# Altium schematic sheet Sch1.SchDoc
size 420 x 297 mm; Address1: Address1; Address2: Address2; Address3: Address3; Address4: Address4; DocumentNumber: ADHF20_AB; SheetNumber: 1; Scale: 1:1; DocumentType: Схема электрическая принципиальная; FirstReferrence: ADHF20_AB
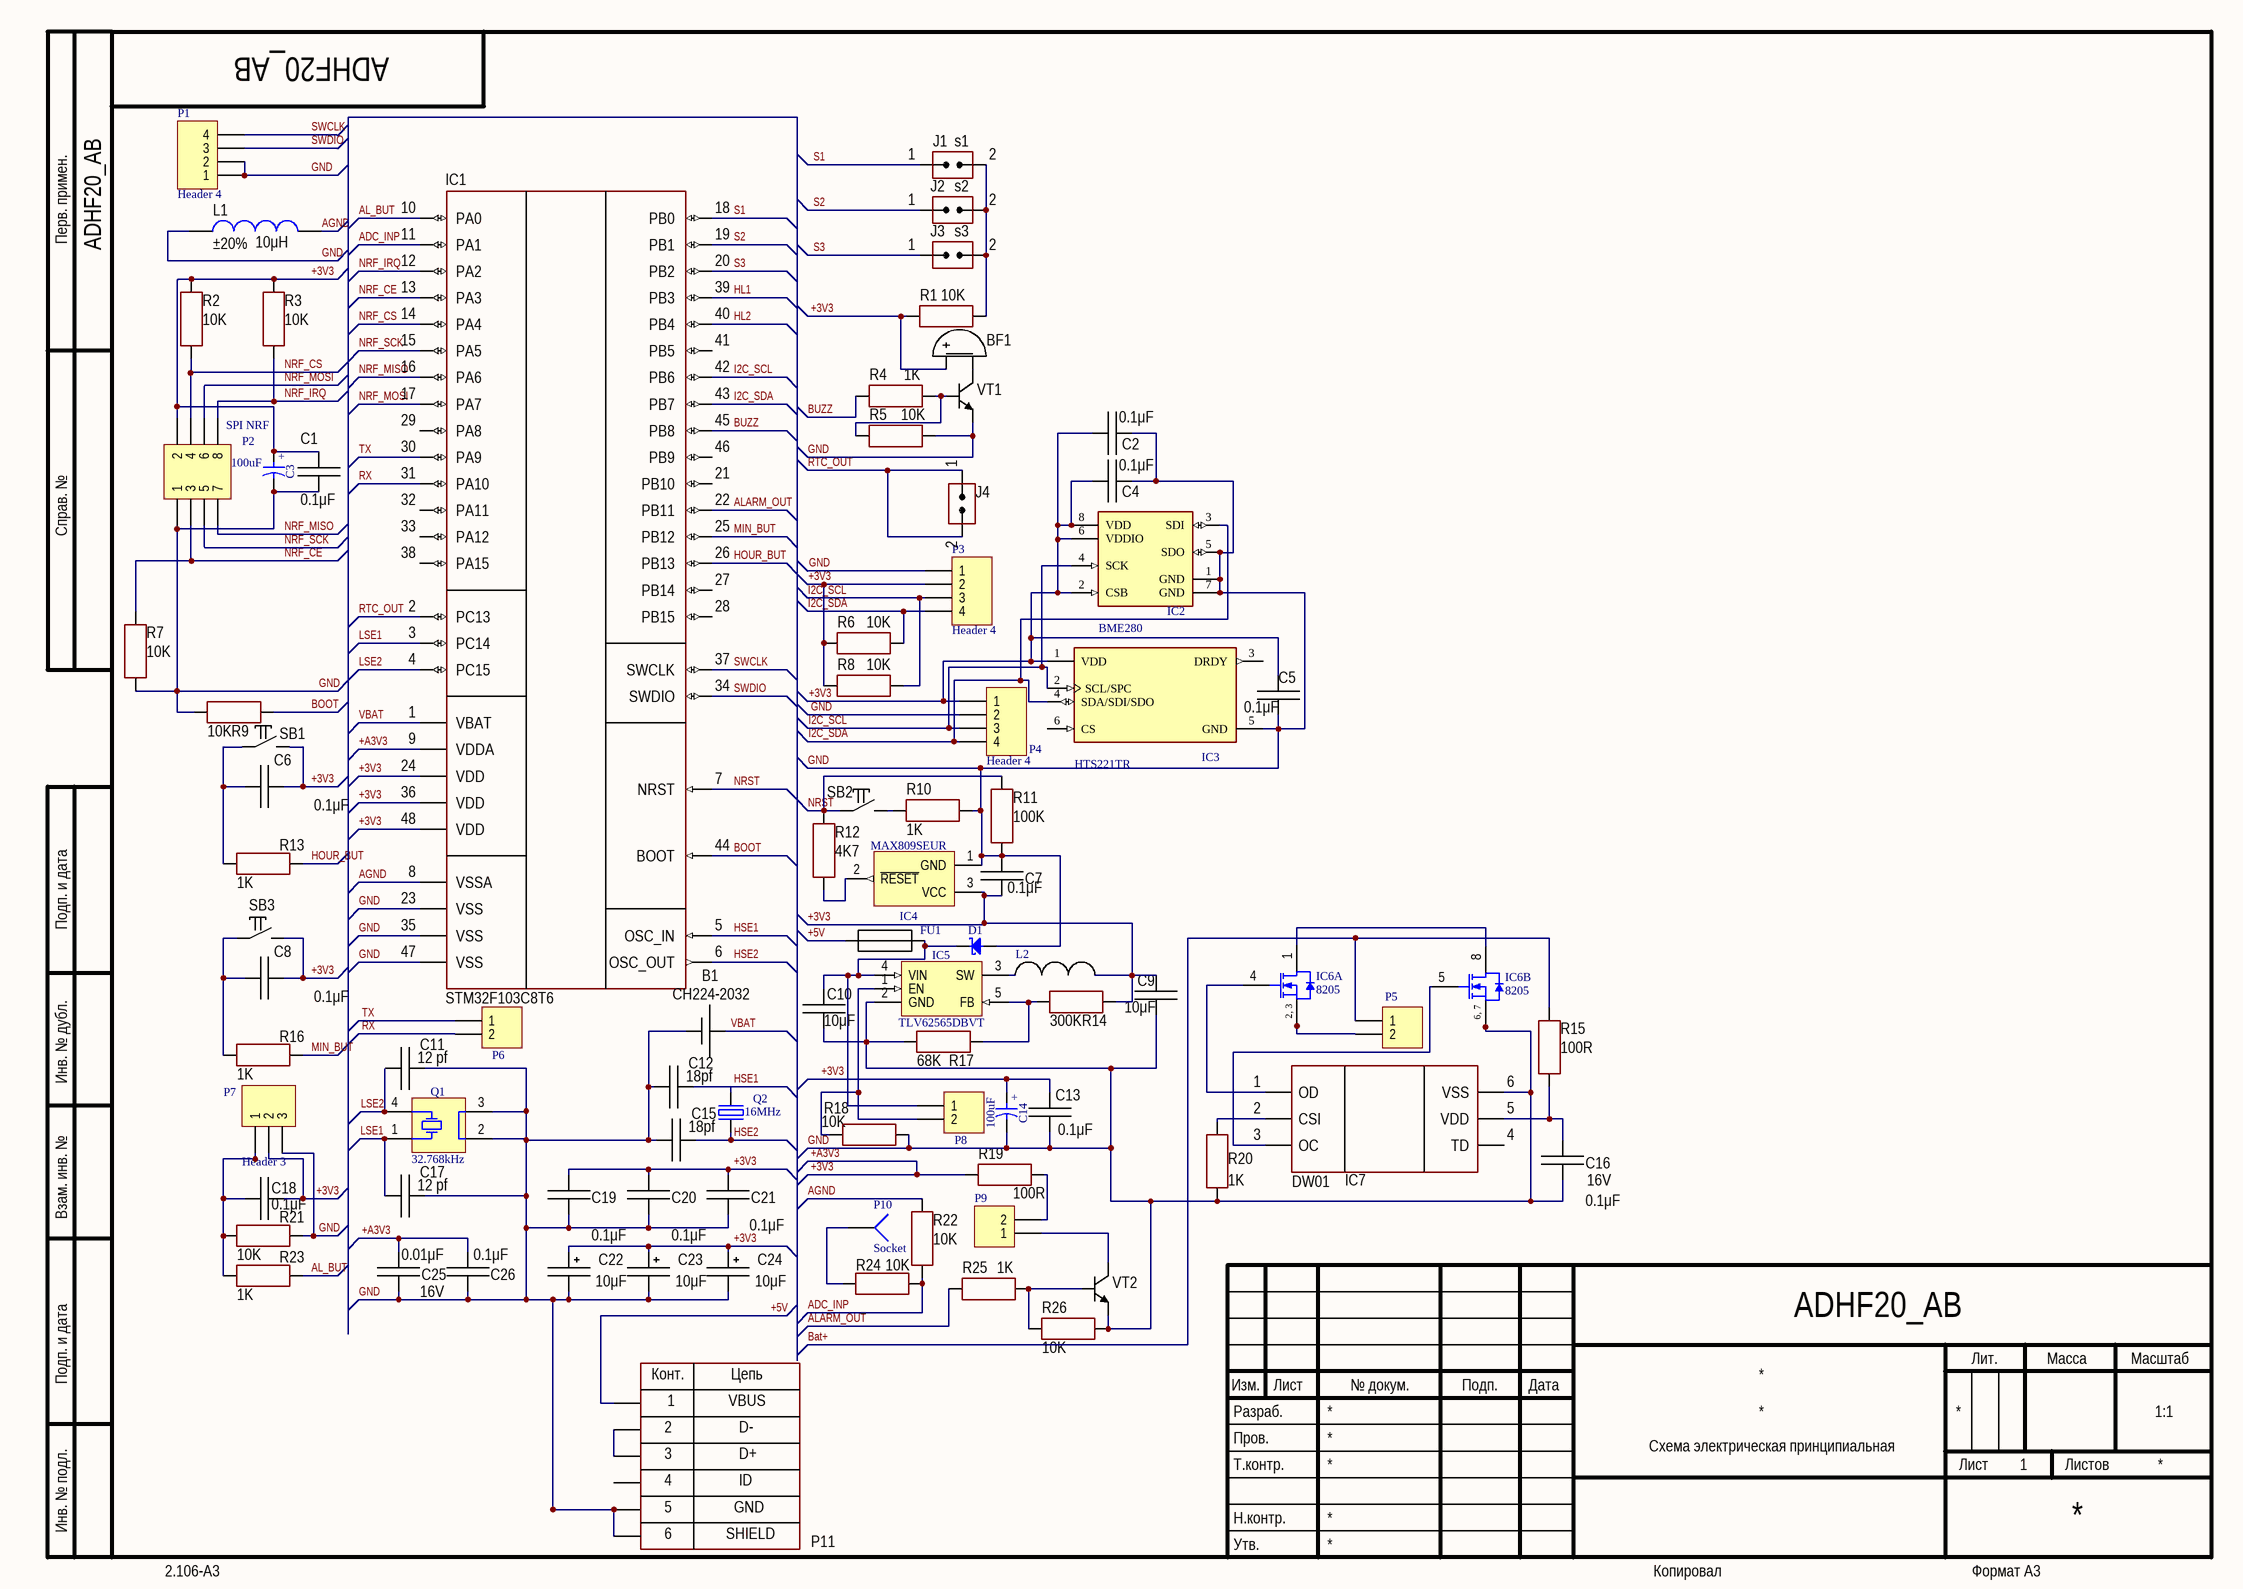
[diagram p0: Sch1.SchDoc]

## Parts
B1  PartNumber: CH224-2032  [BAT: CH224-2032]
BF1  (no value)  [BUZ: AT-0927-TT-6-R]
C1  value 0.1μF  [CAP: 0603]
C2  value 0.1μF  [CAP: 0603]
C3  100uF  [CAPAE660X540N]
C4  value 0.1μF  [CAP: 0603]
C5  value 0.1μF  [CAP: 0603]
C6  value 0.1μF  [CAP: 0603]
C7  value 0.1μF  [CAP: 0603]
C8  value 0.1μF  [CAP: 0603]
C9  value 10μF  [CAP: 0805]
C10  value 10μF  [CAP: 0805]
C11  value 12 pf  [CAP: 0603]
C12  value 18pf  [CAP: 0603]
C13  value 0.1μF  [CAP: 0603]
C14  100uF  [CAPAE660X540N]
C15  value 18pf  [CAP: 0603]
C16  value 0.1μF  Voltage: 16V  [CAP: 0603]
C17  value 12 pf  [CAP: 0603]
C18  value 0.1μF  [CAP: 0603]
C19  value 0.1μF  [CAP: 0603]
C20  value 0.1μF  [CAP: 0603]
C21  value 0.1μF  [CAP: 0603]
C22  value 10μF  [CAP: TANTAL-A]
C23  value 10μF  [CAP: TANTAL-A]
C24  value 10μF  [CAP: TANTAL-A]
C25  value 0.01μF  Voltage: 16V  [CAP: 0603]
C26  value 0.1μF  [CAP: 0603]
D1  Device  [DIOM7659X265N]  (value not drawn)
FU1  1812L010  [C1812Fuse]  (value not drawn)
IC1  (no value)  [48-LQFP]
IC2  BME280  [Bosch_BME280_0]  (value not drawn)
IC3  HTS221TR  [STMicroelectronics_HTS221TR_0]  (value not drawn)
IC4  MAX809SEUR  [SOT95P230X112-3N]
IC5  TLV62565DBVT  [SOT95P280X145-5N]
IC6  8205  [TSSOP-8]  (parts A,B of 2)
IC7  PartNumber: DW01  [SOT23-6]
J1  CommentText: s1  [CON: JUMPER x1]
J2  CommentText: s2  [CON: JUMPER x1]
J3  CommentText: s3  [CON: JUMPER x1]
J4  (no value)  [CON: JUMPER x1]
L1  value 10μH  Tolerance: ±20%  [IND: 0805]
L2  LQH44PN2R2MP0L  [LQH44PP(1515)]  (value not drawn)
P1  Header 4  [HDR1X4]
P2  SPI NRF  [HDR2X4]
P3  Header 4  [HDR1X4]
P4  Header 4  [HDR1X4]
P5  Header 2  [HDR1X2]  (value not drawn)
P6  Header 2  [HDR1X2]  (value not drawn)
P7  Header 3  [HDR1X3]
P8  Header 2  [HDR1X2]  (value not drawn)
P9  Header 2  [HDR1X2]  (value not drawn)
P10  Socket  [PIN1]
P11  (no value)  [CON: USB micro-A (ZX62-B-5PA)]
Q1  32.768kHz  [XTAL_EPSON_MC-406]
Q2  16MHz  [XTAL1160X490X430]
R1  value 10K  [RES: 0603]
R2  value 10K  [RES: 0603]
R3  value 10K  [RES: 0603]
R4  value 1K  [RES: 0603]
R5  value 10K  [RES: 0603]
R6  value 10K  [RES: 0603]
R7  value 10K  [RES: 0603]
R8  value 10K  [RES: 0603]
R9  value 10K  [RES: 0603]
R10  value 1K  [RES: 0603]
R11  value 100K  [RES: 0603]
R12  value 4K7  [RES: 0603]
R13  value 1K  [RES: 0603]
R14  value 300K  [RES: 0603]
R15  value 100R  [RES: 0603]
R16  value 1K  [RES: 0603]
R17  value 68K  [RES: 0603]
R18  value 10K  [RES: 0603]
R19  value 100R  [RES: 1206]
R20  value 1K  [RES: 0603]
R21  value 10K  [RES: 0603]
R22  value 10K  [RES: 0603]
R23  value 1K  [RES: 0603]
R24  value 10K  [RES: 0603]
R25  value 1K  [RES: 0603]
R26  value 10K  [RES: 0603]
SB1  (no value)  [BUT: 6x6]
SB2  (no value)  [BUT: 6x6]
SB3  (no value)  [BUT: 6x6]
VT1  (no value)  [SOT23]
VT2  (no value)  [SOT23]

## Nets
+3V3: BF1.1(+) C1.2 C2.1 C3.1 C4.1 C5.2 C6.2 C7.1 C8.2 C9.2 C13.2 C14.1 C18.2 C19.2 C20.2 C21.2 C22.1 C23.1 C24.1 C25.2 C26.2 IC1.9(VDDA) IC1.24(VDD) IC1.36(VDD) IC1.48(VDD) IC2.2(CSB) IC2.6(VDDIO) IC2.8(VDD) IC3.1(VDD) IC4.3(VCC) L2.2 P2.2 P3.2 P4.1 P7.2 R1.1 R2.2 R3.2 R6.2 R8.2 R14.1 R19.1 SB1.2 SB3.2  [also labelled +A3V3]
+5V: FU1.2 P11.1
ADC_INP: IC1.11(PA1) R22.1 R24.1
AGND: IC1.8(VSSA) L1.1 R22.2
AL_BUT: IC1.10(PA0) R23.2
ALARM_OUT: IC1.22(PB11) R25.1
Bat+: P5.1 R15.1
BOOT: IC1.44(BOOT) R9.1
BUZZ: IC1.45(PB8) R4.1
GND: B1.2(-) C1.1 C2.2 C3.2 C4.2 C5.1 C7.2 C9.1 C10.1 C11.2 C12.1 C13.1 C14.2 C15.1 C16.1 C17.2 C19.1 C20.1 C21.1 C22.2 C23.2 C24.2 C25.1 C26.1 D1.2(A) IC1.23(VSS) IC1.35(VSS) IC1.47(VSS) IC2.1(GND) IC2.5(SDO) IC2.7(GND) IC3.5(GND) IC4.1(GND) IC5.2(GND) IC6.6(S) IC6.7(S) IC7.6(VSS) L1.2 P1.1 P1.2 P2.1 P3.1 P4.2 P7.3 P11.0 P11.5 Q1.2(GND) Q1.3(GND) R5.2 R7.1 R9.2 R10.2 R11.2 R17.1 R18.1 R20.1 R21.2 R26.1 VT1.2(E) VT2.2(E)
HL1: IC1.39(PB3)
HL2: IC1.40(PB4)
HOUR_BUT: IC1.26(PB13) R13.2
HSE1: C12.2 IC1.5(OSC_IN) Q2.2(OSC2)
HSE2: C15.2 IC1.6(OSC_OUT) Q2.1(OSC1)
I2C_SCL: IC1.42(PB6) IC2.4(SCK) IC3.2(SCL/SPC) P3.3 P4.3 R8.1
I2C_SDA: IC1.43(PB7) IC2.3(SDI) IC3.4(SDA/SDI/SDO) P3.4 P4.4 R6.1
LSE1: C17.1 IC1.3(PC14) Q1.1(X)
LSE2: C11.1 IC1.4(PC15) Q1.4(X)
MIN_BUT: IC1.25(PB12) R16.2
NRF_CE: IC1.13(PA3) P2.3 R7.2
NRF_CS: IC1.14(PA4) P2.4 R2.1
NRF_IRQ: IC1.12(PA2) P2.8 R3.1
NRF_MISO: IC1.16(PA6) P2.7
NRF_MOSI: IC1.17(PA7) P2.6
NRF_SCK: IC1.15(PA5) P2.5
NRST: IC1.7(NRST) R11.1 R12.2 SB2.1
RTC_OUT: IC1.2(PC13) J4.1(IN) J4.2(IN)
RX: IC1.31(PA10) P6.2
S1: IC1.18(PB0) J1.1(IN)
S2: IC1.19(PB1) J2.1(IN)
S3: IC1.20(PB2) J3.1(IN)
SWCLK: IC1.37(SWCLK) P1.4
SWDIO: IC1.34(SWDIO) P1.3
TX: IC1.30(PA9) P6.1
VBAT: B1.1(+) IC1.1(VBAT)
NetBF1_2: BF1.2(-) VT1.3(C)
NetC6_1: C6.1 R13.1 SB1.1
NetC8_1: C8.1 R16.1 SB3.1
NetC10_2: C10.2 D1.1(C) FU1.1 IC5.4(VIN) P8.1
NetC16_2: C16.2 IC7.5(VDD) R15.2
NetC18_1: C18.1 P7.1 R21.1 R23.1
NetIC4_2: IC4.2(~{RESET}) R12.1
NetIC5_1: IC5.1(EN) P8.2 R18.2
NetIC5_3: IC5.3(SW) L2.1
NetIC5_5: IC5.5(FB) R14.2 R17.2
NetIC6_1: IC6.1(D) IC6.8(D)
NetIC6_2: IC6.2(S) IC6.3(S) P5.2
NetIC6_4: IC6.4(G) IC7.1(OD)
NetIC6_5: IC6.5(G) IC7.3(OC)
NetIC7_2: IC7.2(CSI) R20.2
NetJ1_2: J1.2(IN) J2.2(IN) J3.2(IN) R1.2
NetP9_1: P9.1 VT2.3(C)
NetP9_2: P9.2 R19.2
NetP10_1: P10.1 R24.2
NetP11_2: P11.2 P11.3
NetR4_2: R4.2 R5.1 VT1.1(B)
NetR10_1: R10.1 SB2.2
NetR25_2: R25.2 R26.2 VT2.1(B)

Not connected (* = marked no-connect by the designer): IC1 21(PB10) 27(PB14) 28(PB15) 29(PA8) 32(PA11) 33(PA12) 38(PA15) 41(PB5) 46(PB9); IC3 3(DRDY) 6(CS); IC7 4(TD); P11 4

## Notes on the sheet
- Перв. примен.
- Справ. №
- Подп. и дата
- Инв. № дубл.
- Взам. инв. №
- Разраб.
- Изм.
- Лист
- № докум.
- Подп.
- Дата
- Лит.
- Масса
- Масштаб
- Пров.
- Т.контр.
- Листов
- Инв. № подл.
- Утв.
- Н.контр.
- 2.106-A3
- Копировал
- Формат А3
- (in symbol CAE660-540_100UF_16V_20%) +
- (in symbol Connector_USB_micro_B) Конт.; Цепь; VBUS; D-; D+; ID; GND; 6; SHIELD
- (in symbol SI6956DQ, part A) 2, 3
- (in symbol SI6956DQ, part B) 6, 7

## Library data of the parts
B1 = Connector_CH224-2032: Manufacturer: KLS; ValueManufacturerPartNumber: Single battery CR2032; CommentText: CR2032; HelpURL: https://www.chipdip.ru/product/bh-642; TypeConnector: Single battery CR2032
BF1 = Buzzer: Manufacturer: PUI Audio; ValueManufacturerPartNumber: DIP switch, 2.73 kHz, 3VDC, 80mA, -20...+70°C; PartNumber: AT-0927-TT-6-R; TypeBuzzer: DIP switch; VoltageMax: 3VDC; Frequency: 2.73 kHz; CurrentMax: 80mA; HelpURL: https://www.digikey.com/products/en?keywords=AT-0927-TT-6-R; Temperature: -20...+70°C
C1 C5 = Ceramic_0603: Manufacturer: Yageo; PartNumber: CC0603KRX7R7BB104; TypeCapacitor: Ceramic capacitor; Tolerance: ±10%; TypeDielectric: X7R; Package: 0603; HelpURL: https://www.digikey.com/product-detail/en/yageo/CC0603KRX7R7BB104/311-1088-1-ND/302998; ValueManufacturerPartNumber: =TypeCapacitor+', '+Value+', '+TypeDielectric+', '+Tolerance+', '+Voltage+', '+Package+', '+Temperature; Temperature: -55...+125°C
C2 C4 C6-C8 C13 C18-C21 C26 = Ceramic_0603: Manufacturer: Yageo; PartNumber: CC0603KRX7R7BB104; ValueManufacturerPartNumber: Ceramic capacitor, 0.1μF, X7R, ±10%, 16V, 0603, -55...+125°C; TypeCapacitor: Ceramic capacitor; Tolerance: ±10%; TypeDielectric: X7R; Voltage: 16V; Package: 0603; HelpURL: https://www.digikey.com/product-detail/en/yageo/CC0603KRX7R7BB104/311-1088-1-ND/302998; Temperature: -55...+125°C
C3 C14 = CAE660-540_100UF_16V_20%: Polarised capacitor; Part Description: Aluminum Electrolytic SMT Capacitor; Manufacturer: PANASONIC; Manufacturer Part Number: EEEFK1C101AP; Voltage: 16V; Tolerance: ±20%; Part Number: CAE660-540_100UF_16V_20%; Component Kind: Standard; Component Type: Standard; Pin Count: 2; Value: 100uF; Status: Not Recommended; Case: D; Mounted: Yes; Socket: No; SMD: Yes; Sense: No; ComponentHeight: 5.8mm; HelpURL: \\cern.ch\dfs\Applications\Altium\Datasheets\CAE_PANASONIC_FK.pdf; Author: CERN DEM JLC; CreateDate: 03.12.2007; LatestRevisionDate: 05.11.2014
C9 C10 = Ceramic_0805: Manufacturer: Murata Electronics; PartNumber: GCD21BR72A104KA01L; ValueManufacturerPartNumber: Ceramic capacitor, 10μF, X7R, ±10%, , 0805, -55...+125°C; TypeCapacitor: Ceramic capacitor; Tolerance: ±10%; TypeDielectric: X7R; Package: 0805; HelpURL: https://www.digikey.com/product-detail/en/murata-electronics/GCD21BR72A104KA01L/490-14407-1-ND/6606868; Temperature: -55...+125°C
C11 C17 = Ceramic_0603: Manufacturer: Yageo; PartNumber: CC0603KRX7R7BB104; ValueManufacturerPartNumber: Ceramic capacitor, 12 pf, X7R, ±10%, 16V, 0603, -55...+125°C; TypeCapacitor: Ceramic capacitor; Tolerance: ±10%; TypeDielectric: X7R; Voltage: 16V; Package: 0603; HelpURL: https://www.digikey.com/product-detail/en/yageo/CC0603KRX7R7BB104/311-1088-1-ND/302998; Temperature: -55...+125°C
C12 C15 = Ceramic_0603: Manufacturer: Yageo; PartNumber: CC0603KRX7R7BB104; ValueManufacturerPartNumber: Ceramic capacitor, 18pf, X7R, ±10%, 16V, 0603, -55...+125°C; TypeCapacitor: Ceramic capacitor; Tolerance: ±10%; TypeDielectric: X7R; Voltage: 16V; Package: 0603; HelpURL: https://www.digikey.com/product-detail/en/yageo/CC0603KRX7R7BB104/311-1088-1-ND/302998; Temperature: -55...+125°C
C16 = Ceramic_0603: Manufacturer: Yageo; PartNumber: CC0603KRX7R7BB104; ValueManufacturerPartNumber: Ceramic capacitor, 0.1μF, X7R, ±10%, 16V, 0603, -55...+125°C; TypeCapacitor: Ceramic capacitor; Tolerance: ±10%; TypeDielectric: X7R; Package: 0603; HelpURL: https://www.digikey.com/product-detail/en/yageo/CC0603KRX7R7BB104/311-1088-1-ND/302998; Temperature: -55...+125°C
C22-C24 = Tantal_A: Manufacturer: Vishay Sprague; PartNumber: 293D106X96R3A2TE3; ValueManufacturerPartNumber: Tantalum capacitor, 10μF, 6.3V, ±10%, 3.4Ohm, case A (3216), -55...+125°C; Impedance: 3.4Ohm; Tolerance: ±10%; TypeDielectric: X7R; TypeCapacitor: Tantalum capacitor; Voltage: 6.3V; Package: case A (3216); HelpURL: https://www.digikey.com/product-detail/en/vishay-sprague/293D106X96R3A2TE3/718-1126-1-ND/1559620; Temperature: -55...+125°C
C25 = Ceramic_0603: Manufacturer: Yageo; PartNumber: CC0603KRX7R7BB104; ValueManufacturerPartNumber: Ceramic capacitor, 0.01μF, X7R, ±10%, 16V, 0603, -55...+125°C; TypeCapacitor: Ceramic capacitor; Tolerance: ±10%; TypeDielectric: X7R; Package: 0603; HelpURL: https://www.digikey.com/product-detail/en/yageo/CC0603KRX7R7BB104/311-1088-1-ND/302998; Temperature: -55...+125°C
D1 = SS34: Schottky Diode; Part Number: SS34; Part Description: Surface Mount Schottky Barrier Rectifier; Manufacturer: FAIRCHILD SEMICONDUCTOR; Voltage: 40V; Power: 3A; PressFit: No; Bonding: No; Component Kind: Standard; Component Type: Standard; Device: SS34; PackageDescription: DO-214-AB/SMC Molded Diode, Body 7.95x5.9mm, IPC Medium Density; Manufacturer Part Number: SS34; Pin Count: 2; Case: DO-214AC; Mounted: Yes; Socket: No; SMD: Yes; Sense: No; ComponentHeight: 2.65mm; HelpURL: \\cern.ch\dfs\Applications\Altium\Datasheets\SS34.pdf; Author: CERN DEM JLC; CreateDate: 23.08.2010; LatestRevisionDate: 23.08.2010
FU1 = 1812L010: SMD 1812 0,3А 30V; Manufacturer: Littelfuse, Inc.; BOM: 1812L010, 1812 0,3A 30V; Current: 0,3A; Part Number: 1812L010; Package: SMD 1812; Footprint Patch: pcb.pcblib; Voltage: 30V; ComponentLink1URL: https://sds.compel.ru/item-pdf/b89835bf867f48e848cf72775db4e3e5/ps/ltl~polyfusev---1812l.pdf; ComponentLink1Description: Datasheet; Category: FUSE
IC1 = STM32F103C8T6: Cortex-M3; Manufacturer: STMicroelectronics; ValueManufacturerPartNumber: IC microcontroller, 32-Bit, Cortex-M3, 72MHz, 64KB, 20KB, 2...3.6V, -40...+85°C, 48-LQFP; Supply: 2...3.6V; Speed: 72MHz; CoreSize: 32-Bit; MemoryROM: 64KB; MemoryRAM: 20KB; HelpURL: https://www.digikey.com/product-detail/en/stmicroelectronics/STM32F103C8T6TR/497-17666-1-ND/7804402; Package: 48-LQFP; ComponentType: IC microcontroller; Temperature: -40...+85°C; CoreProcessor: Cortex-M3; PartNumber: STM32F103C8T6
IC2 = BME280: IC Humidity, Pressure, Temperature Sensor I²C Output; Manufacturer: Bosch; Capacitance: SKIP; Library Path1: parts/IC_Bosch_BME280_eec.SchLib; Value: SKIP; Part Number: BME280; Datasheet Path: datasheets/IC_Bosch_BME280_eec.pdf; ComponentLink1Description: Upverter; ComponentLink1URL: https://upverter.com/upn/revision/d5e36e2395010120/; ComponentLink2Description: Datasheet; ComponentLink2URL: http://datasheet.octopart.com/BME280-Bosch-datasheet-34148998.pdf; Datasheet Path1: datasheets/IC_Bosch_BME280_eec.pdf; Digikey Description: IC Humidity, Pressure, Temperature Sensor I²C Output; Digikey Part Number: 828-1063-1-ND; Inductance: SKIP; Lead Free: yes; Library Ref1: BME280; Mouser Part Number: 262-BME280; Octopart Part Number: a1c26bef29297e05; Package: DFN8; Price: 6.22612925365; Resistance: SKIP; RoHS: TRUE; Supplier 1: Digi-Key; Supplier 2: Mouser; Supplier Part Number 1: 828-1063-1-ND; Supplier Part Number 2: 262-BME280; Temperature: -40°C to +85°C; Temperature Range High: +85°C; Temperature Range Low: -40°C; Voltage: SKIP; helpURL: https://upverter.com/upn/revision/d5e36e2395010120/
IC3 = HTS221TR: IC SENS HUMI/TEMP 2.5V I2C 4.5% SMD; Manufacturer: STMicroelectronics; Capacitance: SKIP; Interface: I2C,SPI,Other; Library Path1: parts/IC_STMicroelectronics_HTS221TR_eec.SchLib; Max Supply Voltage: 3.6V; Min Supply Voltage: 1.7V; Operating Supply Current: 2uA; Resolution: 16b; Standoff Height: 0mm; Value: SKIP; Verification Version: 0.0.0.1; Part Number: HTS221TR; Datasheet Path: datasheets/IC_STMicroelectronics_HTS221TR_eec.pdf; Accuracy: 4.5%; ComponentLink1Description: Upverter; ComponentLink1URL: https://upverter.com/upn/revision/23fd6bd49ff9d81b/; ComponentLink2Description: Datasheet; ComponentLink2URL: http://www.st.com/content/ccc/resource/technical/document/datasheet/4d/9a/9c/ad/25/07/42/34/DM00116291.pdf/files/DM00116291.pdf/jcr:content/translations/en.DM00116291.pdf; Datasheet Path1: datasheets/IC_STMicroelectronics_HTS221TR_eec.pdf; Digikey Description: IC SENS HUMI/TEMP 2.5V I2C 4.5% SMD; Digikey Part Number: 497-15382-1-ND; Footprint Url: http://www.st.com/content/ccc/resource/technical/document/technical_note/3a/39/78/0d/81/40/4c/0d/DM00150328.pdf/files/DM00150328.pdf/jcr:content/translations/en.DM00150328.pdf; Height: 1mm; Inductance: SKIP; Lead Free: yes; Library Ref1: HTS221TR; Mouser Part Number: 511-HTS221TR; Package: HTS221TR; Price: 2.44531532234; Resistance: SKIP; RoHS: TRUE; Sensor Output: I2C,SPI,Other; Supplier 1: Digi-Key; Supplier 2: Mouser; Supplier Part Number 1: 497-15382-1-ND; Supplier Part Number 2: 511-HTS221TR; Temperature: -40°C to +120°C; Temperature Range High: +120°C; Temperature Range Low: -40°C; Voltage: SKIP; helpURL: https://upverter.com/upn/revision/23fd6bd49ff9d81b/
IC4 = MAX809MEUR: 3-Pin Microprocessor Reset Circuit; Part Description: 3-Pin Microprocessor Reset Circuit (Reset Threshold 4.38V); Manufacturer: MAXIM; PressFit: No; Bonding: No; Part Number: MAX809SEUR; Component Kind: Standard; Component Type: Standard; Device: MAX809SEUR; PackageDescription: SOT23 3-Leads, Pitch 0.95mm - Body 1.3x2.86mm, IPC Medium Density; Manufacturer Part Number: MAX809SEUR; Pin Count: 3; Case: SOT23; Mounted: Yes; Socket: No; SMD: Yes; Sense: No; ComponentHeight: 1.12mm; HelpURL: \\cern.ch\dfs\Applications\Altium\Datasheets\MAX809MEUR.pdf; Author: CERN DEM JLC; CreateDate: 23.08.2012; LatestRevisionDate: 23.08.2012
IC5 = TLV62565DBVT: 1.5A High Efficiency Step-Down Converter, Adjustable Output Voltage; Manufacturer: TEXAS INSTRUMENTS; PressFit: No; Bonding: No; Part Number: TLV62565DBVT; Component Kind: Standard; Component Type: Standard; Device: TLV62565DBVT; PackageDescription: SOT, 0.95mm Pitch; 5 Pin, 1.60mm W X 2.90mm L X 1.45mm H Body, IPC Medium Density; Part Description: 1.5A High Efficiency Step-Down Converter, Adjustable Output Voltage; Manufacturer Part Number: TLV62565DBVT; Pin Count: 5; Case: SOT23-5; Mounted: Yes; Socket: No; SMD: Yes; Sense: No; ComponentHeight: 1.45mm; HelpURL: \\cern.ch\dfs\Applications\Altium\Datasheets\TLV62565DBVT.pdf; Author: CERN DEM JMW; CreateDate: 29.08.2016; LatestRevisionDate: 29.08.2016
IC6 = SI6956DQ: Dual N-Channel Enhancement-Mode  MOSFET; Published: 8-Jun-2000; LatestRevisionDate: 04-Mar-2005; LatestRevisionNote: Stylized 3D Model Added.; DatasheetVersion: 15-Apr-1996; PackageVersion: Aug-1998; PackageReference: TSSOP-8; Publisher: Altium Limited; PackageDescription: Shrink Small Outline; 8 Leads; Body Width 4.4 mm; Pitch 0.65 mm; ComponentLink1Description: Manufacturer Link; ComponentLink1URL: http://www.vishay.com/; ComponentLink2Description: Datasheet; ComponentLink2URL: http://www.vishay.com/docs/70173/70173.pdf
IC7 = SN6505ADBVR: ValueManufacturerPartNumber: , , , External transformer, 1.7A, -55...+125°C,; CurrentOutput: 1.7A; VoltageOutput: External transformer; Temperature: -55...+125°C
J1-J4 = Jumper_single
L1 = Inductor_0805: Manufacturer: Murata Electronics; PartNumber: LQM21FN100M70L; ValueManufacturerPartNumber: Fixed inductor, 10μH, ±20%, 0805, 100mA, -55...+125°C; TypeInductor: Fixed inductor; MaxCurrent: 100mA; Package: 0805; HelpURL: https://www.digikey.com/product-detail/en/murata-electronics-north-america/LQM21FN100M70L/490-4029-1-ND/1016289; Temperature: -55...+125°C
L2 = LQH44PN2R2MP0L: Manufacturer: MURATA; BOM: LQH44PN2R2MP0L, 2,2uH; Value: 2,2uH; Current: 1800; Part Number: LQH44PN2R2MP0L; Footprint Patch: transform.PcbLib; ComponentLink1URL: http://www.mouser.com/catalog/catalogusd/645/1188.pdf; ComponentLink1Description: Datasheet; Category: L
P1 P3 P4 = Header 4: Header, 4-Pin; LatestRevisionDate: 17-Jul-2002; LatestRevisionNote: Re-released for DXP Platform.; Publisher: Altium Limited
P2 = Header 4X2: Header, 4-Pin, Dual row; LatestRevisionDate: 17-Jul-2002; LatestRevisionNote: Re-released for DXP Platform.; Publisher: Altium Limited
P5 P6 P8 P9 = Header 2: Header, 2-Pin; LatestRevisionDate: 17-Jul-2002; LatestRevisionNote: Re-released for DXP Platform.; Publisher: Altium Limited
P7 = Header 3: Header, 3-Pin; LatestRevisionDate: 17-Jul-2002; LatestRevisionNote: Re-released for DXP Platform.; Publisher: Altium Limited
P11 = Connector_USB_micro_B: Manufacturer: Hirose Electric; ValueManufacturerPartNumber: USB micro B; PartNumber: ZX62-B-5PA; HelpURL: https://www.digikey.com/product-detail/en/hirose-electric-co-ltd/ZX62-B-5PA/H11579CT-ND/1851090; TypeConnector: USB micro B
Q1 = XTAL_32.768KHZ_EPSON_MC-406 32.768K-A3:ROHS: Crystal 4 pins 1=XTAL Control 2 And 3=NC 4=XTAL; Part Description: Load capacitance 12.5pF, Frequency Tolerance ±20 ppm, 40°C to 85°C, Surface Mount Quartz Crystal, MC-406 Series; Manufacturer: EPSON TOYOCOM; PressFit: No; Bonding: No; Part Number: XTAL_32.768KHZ_EPSON_MC-406 32.768K-A3:ROHS; Component Kind: Standard; Component Type: Standard; PackageDescription: EPSON Crystal; 10.41mm L X 4.06mm W X 3.6mm H; Value: 32.768kHz; Manufacturer Part Number: MC-406 32.768K-A3:ROHS; Pin Count: 4; Mounted: Yes; Socket: No; SMD: Yes; Sense: No; ComponentHeight: 3.6mm; HelpURL: \\cern.ch\dfs\Applications\Altium\Datasheets\XTAL_EPSON_MC-406.pdf; ComponentLink1URL: \\cern.ch\dfs\Applications\Altium\Datasheets\XTAL_EPSON_MC-406_Ordering-Informations.pdf; ComponentLink1Description: Ordering Informations; Author: CERN DEM JLC; CreateDate: 27.03.2012; LatestRevisionDate: 30.01.2013
Q2 = XTAL_16MHZ_IQD_LFXTAL003237: Quartz Crystal; Part Description: Tolerance: ± 30ppm, Stability: ± 50ppm, -10°C to +60°C, 16pF, Surface Mount Quartz Crystal, HC49/4HSMX Series; Manufacturer: IQD FREQUENCY PRODUCTS; PressFit: No; Bonding: No; Part Number: XTAL_16MHZ_IQD_LFXTAL003237; Component Kind: Standard; Component Type: Standard; PackageDescription: HC49/4H SMX Case, SMD Cristal, Body 11.6x4.9mm; Value: 16MHz; Manufacturer Part Number: LF XTAL003237; Pin Count: 2; Mounted: Yes; Socket: No; SMD: Yes; Sense: No; ComponentHeight: 4.3mm; HelpURL: \\cern.ch\dfs\Applications\Altium\Datasheets\XTAL_IQD_LFXTAL003237.pdf; Author: CERN DEM MR; CreateDate: 23.03.2016; LatestRevisionDate: 07.11.2016
R1-R3 R5-R9 R18 R21 R22 R24 R26 = Resistor_0603: Manufacturer: Yageo; PartNumber: RC0603JR-07100RL; ValueManufacturerPartNumber: Resistor film, 10K, ±5%, 0603, 0.1W, -55...+125°C; TypeResistor: Resistor film; Power: 0.1W; Tolerance: ±5%; Package: 0603; HelpURL: https://www.digikey.com/product-detail/en/yageo/RC0603JR-07100RL/311-100GRCT-ND/729644; Temperature: -55...+125°C
R4 R10 R13 R16 R23 R25 = Resistor_0603: Manufacturer: Yageo; PartNumber: RC0603JR-07100RL; ValueManufacturerPartNumber: Resistor film, 1K, ±5%, 0603, 0.1W, -55...+125°C; TypeResistor: Resistor film; Power: 0.1W; Tolerance: ±5%; Package: 0603; HelpURL: https://www.digikey.com/product-detail/en/yageo/RC0603JR-07100RL/311-100GRCT-ND/729644; Temperature: -55...+125°C
R11 = Resistor_0603: Manufacturer: Yageo; PartNumber: RC0603JR-07100RL; ValueManufacturerPartNumber: Resistor film, 100K, ±5%, 0603, 0.1W, -55...+125°C; TypeResistor: Resistor film; Power: 0.1W; Tolerance: ±5%; Package: 0603; HelpURL: https://www.digikey.com/product-detail/en/yageo/RC0603JR-07100RL/311-100GRCT-ND/729644; Temperature: -55...+125°C
R12 = Resistor_0603: Manufacturer: Yageo; PartNumber: RC0603JR-07100RL; ValueManufacturerPartNumber: Resistor film, 4K7, ±5%, 0603, 0.1W, -55...+125°C; TypeResistor: Resistor film; Power: 0.1W; Tolerance: ±5%; Package: 0603; HelpURL: https://www.digikey.com/product-detail/en/yageo/RC0603JR-07100RL/311-100GRCT-ND/729644; Temperature: -55...+125°C
R14 = Resistor_0603: Manufacturer: Yageo; PartNumber: RC0603JR-07100RL; ValueManufacturerPartNumber: Resistor film, 300K, ±5%, 0603, 0.1W, -55...+125°C; TypeResistor: Resistor film; Power: 0.1W; Tolerance: ±5%; Package: 0603; HelpURL: https://www.digikey.com/product-detail/en/yageo/RC0603JR-07100RL/311-100GRCT-ND/729644; Temperature: -55...+125°C
R15 = Resistor_0603: Manufacturer: Yageo; PartNumber: RC0603JR-07100RL; ValueManufacturerPartNumber: Resistor film, 100R, ±1%, 0603, 0.1W, -55...+125°C; TypeResistor: Resistor film; Power: 0.1W; Tolerance: ±1%; Package: 0603; HelpURL: https://www.digikey.com/product-detail/en/yageo/RC0603JR-07100RL/311-100GRCT-ND/729644; Temperature: -55...+125°C
R17 = Resistor_0603: Manufacturer: Yageo; PartNumber: RC0603JR-07100RL; ValueManufacturerPartNumber: Resistor film, 68K, ±5%, 0603, 0.1W, -55...+125°C; TypeResistor: Resistor film; Power: 0.1W; Tolerance: ±5%; Package: 0603; HelpURL: https://www.digikey.com/product-detail/en/yageo/RC0603JR-07100RL/311-100GRCT-ND/729644; Temperature: -55...+125°C
R19 = Resistor_1206: Manufacturer: Yageo; PartNumber: RC1206JR-07100RL; TypeResistor: Resistor film; Power: 0.25W; Package: 1206; HelpURL: https://www.digikey.com/product-detail/en/yageo/RC1206JR-07100RL/311-100ERCT-ND/732153; ValueManufacturerPartNumber: =TypeResistor+', '+Value+', '+Tolerance+', '+Package+', '+Power+', '+Temperature; Temperature: -55...+125°C
R20 = Resistor_0603: Manufacturer: Yageo; PartNumber: RC0603JR-07100RL; ValueManufacturerPartNumber: Resistor film, 1K, ±1%, 0603, 0.1W, -55...+125°C; TypeResistor: Resistor film; Power: 0.1W; Tolerance: ±1%; Package: 0603; HelpURL: https://www.digikey.com/product-detail/en/yageo/RC0603JR-07100RL/311-100GRCT-ND/729644; Temperature: -55...+125°C
SB1-SB3 = Button_tactile: Manufacturer: TE Connectivity; ValueManufacturerPartNumber: Tactile button, 6x6mm; PartNumber: FSM2JSMAATR; TypeButton: Tactile button; CommentText: "Кнопка"; HelpURL: https://www.digikey.com/product-detail/en/te-connectivity-alcoswitch-switches/FSM2JSMAATR/450-1792-1-ND/3503931; Package: 6x6mm
VT1 VT2 = BJT_NPN_132: Manufacturer: ON Semiconductor; ValueManufacturerPartNumber: NPN transistor, 45V, 100mA, 100MHz, 300mW, 0.6V, 420, SOT-23, -55...+125°C; PartNumber: BC847CLT1G; TypeTransistor: NPN transistor; VoltageCE: 45V; CurrentCE: 100mA; VoltageSaturation: 0.6V; Frequency: 100MHz; CurrentGain: 420; MaxPower: 300mW; Package: SOT-23; HelpURL: https://www.digikey.com/product-detail/en/on-semiconductor/BC847CLT1G/BC847CLT1GOSCT-ND/917836; Temperature: -55...+125°C
P10 = Socket: LatestRevisionDate: 17-Jul-2002; LatestRevisionNote: Re-released for DXP Platform.; Publisher: Altium Limited